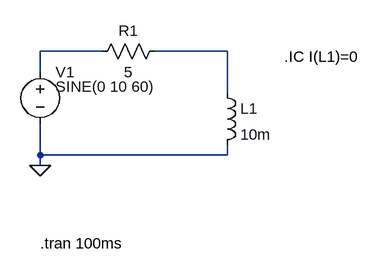
[diagram p0: schematic r-l-circuit.asc]
r-l-circuit.asc, the LTspice schematic file:
Version 4
SHEET 1 880 680
WIRE 304 240 208 240
WIRE 496 240 384 240
WIRE 208 272 208 240
WIRE 496 304 496 240
WIRE 208 400 208 352
WIRE 496 400 496 384
WIRE 496 400 208 400
WIRE 208 416 208 400
FLAG 208 416 0
SYMBOL res 400 224 R90
WINDOW 0 0 56 VBottom 2
WINDOW 3 32 56 VTop 2
SYMATTR InstName R1
SYMATTR Value 5
SYMBOL ind 480 288 R0
SYMATTR InstName L1
SYMATTR Value 10m
SYMBOL voltage 208 256 R0
WINDOW 3 24 38 Left 2
WINDOW 123 24 38 Left 2
SYMATTR InstName V1
SYMATTR Value SINE(0 10 60)
TEXT 208 536 Left 2 !.tran 100ms
TEXT 584 248 Left 2 !.IC I(L1)=0

The netlist it stands for:
* r-l-circuit.asc
R1 N002 N001 5
L1 N002 0 10m
V1 N001 0 SINE(0 10 60)
.tran 100ms
.IC I(L1)=0
.backanno
.end